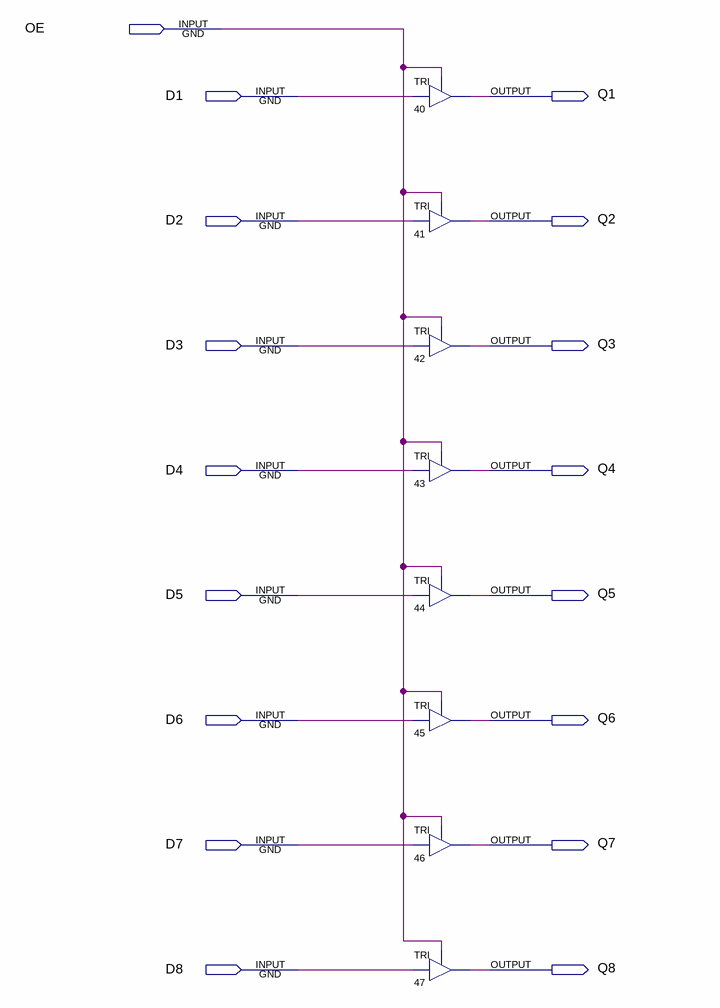
[diagram p0: schematic sheet]
// Quartus schematic tri8.bdf as structural Verilog: 8 symbols, 17 pins
module tri8 (
  input  OE,
  input  D1,
  input  D2,
  input  D3,
  input  D4,
  input  D5,
  input  D6,
  input  D7,
  input  D8,
  output Q1,
  output Q2,
  output Q3,
  output Q4,
  output Q5,
  output Q6,
  output Q7,
  output Q8
);

  TRI u_40 (.IN(D1), .OE(OE), .OUT(Q1));
  TRI u_41 (.IN(D2), .OE(OE), .OUT(Q2));
  TRI u_42 (.IN(D3), .OE(OE), .OUT(Q3));
  TRI u_43 (.IN(D4), .OE(OE), .OUT(Q4));
  TRI u_44 (.IN(D5), .OE(OE), .OUT(Q5));
  TRI u_45 (.IN(D6), .OE(OE), .OUT(Q6));
  TRI u_46 (.IN(D7), .OE(OE), .OUT(Q7));
  TRI u_47 (.IN(D8), .OE(OE), .OUT(Q8));
endmodule
